# Altium schematic sheet Buck Converter.SchDoc: Buck Converter
size Letter; Author: Alfredo Cortellini; Organization: IT Logic; Address1: 5753 Highway 85 N; Address2: Crestview, FL 32536; Address3: United States; DocumentNumber: 4; SheetNumber: 4; SheetTotal: 5; Email: pcb-design@itlogic.cloud
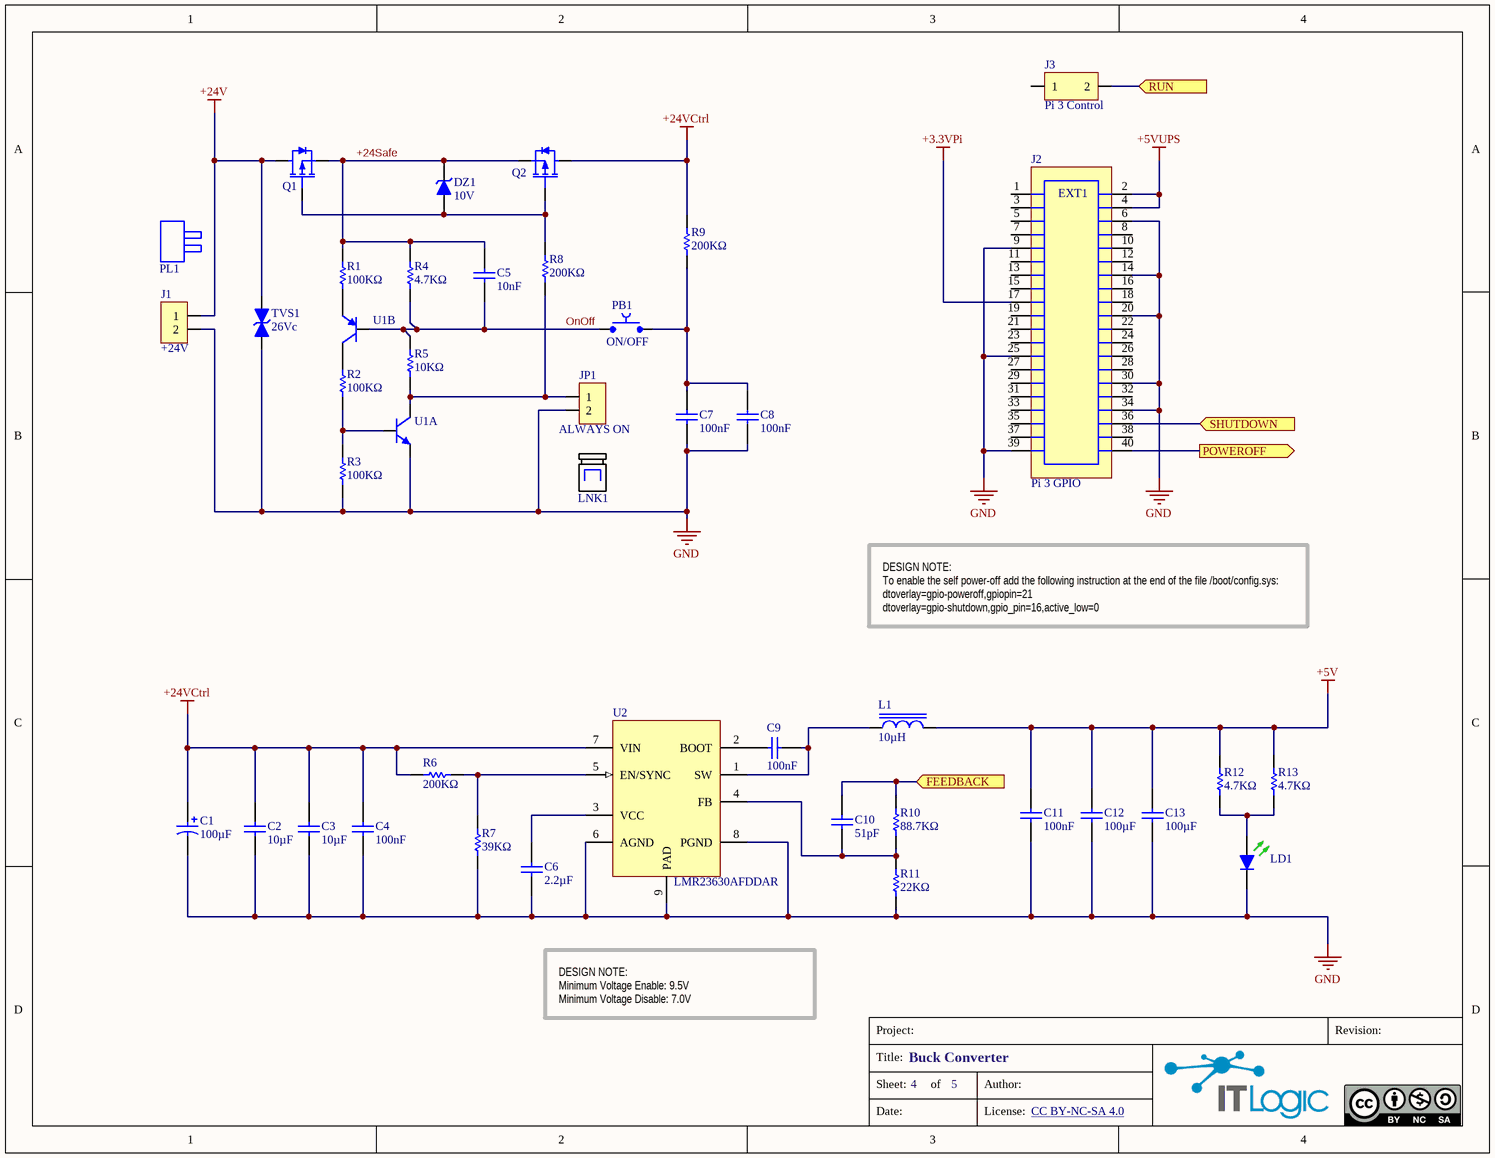
[diagram p0: Buck Converter.SchDoc]

## Parts
C1  100µF  [C-AE-C6-H60]
C2  10µF  [C1206-H180]
C3  10µF  [C1206-H180]
C4  100nF  [C0805-H10]
C5  10nF  [C0805-H10]
C6  2.2µF  [C0805-H140]
C7  100nF  [C0805-H10]
C8  100nF  [C0805-H10]
C9  100nF  [C0805-H10]
C10  51pF  [C0805-H10]
C11  100nF  [C0805-H10]
C12  100µF  [C1210-H250]
C13  100µF  [C1210-H250]
DZ1  10V  [SOD-123]
EXT1  SSQ-120-03-T-D-MEC  [SSQ-120-03-D-BOTTOM]  (value not drawn)
J1  +24V  [691322110002]
J2  Pi 3 GPIO  [HLE-120-02-F-DV-BE]
J3  Pi 3 Control  [SSQ-102-01-S-BOTTOM]
JP1  ALWAYS ON  [HDR-V-1R-02P-5.8L]
L1  10µH  [IND-XAL6060]
LD1  LTST-S220KGKT  [LED-0805-G-SIDE]  (value not drawn)
LNK1  2-881545-2  (value not drawn)  (mechanical)
PB1  ON/OFF  [BUT-1-1825027-4]
PL1  691361100002  (value not drawn)  (mechanical)
Q1  DMP6023LFG  [PowerDI3333-8-S]  (value not drawn)
Q2  DMP6023LFG  [PowerDI3333-8-S]  (value not drawn)
R1  100KΩ  [R0805-H60]
R2  100KΩ  [R0805-H60]
R3  100KΩ  [R0805-H60]
R4  4.7KΩ  [R0805-H60]
R5  10KΩ  [R0805-H60]
R6  200KΩ  [R0805-H60]
R7  39KΩ  [R0805-H60]
R8  200KΩ  [R0805-H60]
R9  200KΩ  [R0805-H60]
R10  88.7KΩ  [R0805-H60]
R11  22KΩ  [R0805-H60]
R12  4.7KΩ  [R0805-H60]
R13  4.7KΩ  [R0805-H60]
TVS1  26Vc  [DO-214AC-SMA-NO POL]
U1  MBT3946DW1T1G  [SOT-363]  (value not drawn)  (parts A,B of 2)
U2  LMR23630AFDDAR  [SOIC-8-N-HT]

## Ports
FEEDBACK (in), POWEROFF (out), RUN (in), SHUTDOWN (in)

## Nets
+3.3VPi: J2.17
+5V: C11.2 C12.2 C13.2 L1.2 R12.2 R13.2
+5VUPS: J2.2 J2.4
+24V: J1.1 Q1.3(D) TVS1.2
+24VCtrl: C1.1 C2.2 C3.2 C4.2 Q2.3(D) R6.2 R9.2 U2.7(VIN)
GND: C1.2 C2.1 C3.1 C4.1 C6.1 C7.1 C8.1 C11.1 C12.1 C13.1 J1.2 J2.6 J2.9 J2.14 J2.20 J2.25 J2.30 J2.34 J2.39 JP1.2 LD1.1(K) R3.1 R7.1 R11.1 TVS1.1 U1.1(E) U2.6(AGND) U2.8(PGND) U2.9(PAD)
+24Safe: C5.2 DZ1.1(K) Q1.1(S) Q2.1(S) R1.1 R4.2
FEEDBACK: C10.2 R10.2 ; port FEEDBACK
OnOff: C5.1 PB1.1 R4.1 R5.1 U1.5(B)
POWEROFF: J2.40 ; port POWEROFF
RUN: J3.2 ; port RUN
SHUTDOWN: J2.36 ; port SHUTDOWN
NetC6_2: C6.2 U2.3(VCC)
NetC7_2: C7.2 C8.2 PB1.2 R9.1
NetC9_1: C9.1 U2.2(BOOT)
NetC9_2: C9.2 L1.1 U2.1(SW)
NetC10_1: C10.1 R10.1 R11.2 U2.4(FB)
NetDZ1_2: DZ1.2(A) Q1.2(G) Q2.2(G) R8.2
NetJP1_1: JP1.1 R5.2 R8.1 U1.6(C)
NetLD1_2: LD1.2(A) R12.1 R13.1
NetR1_2: R1.2 U1.4(E)
NetR2_1: R2.1 R3.2 U1.2(B)
NetR2_2: R2.2 U1.3(C)
NetR6_1: R6.1 R7.2 U2.5(EN/SYNC)

Not connected (* = marked no-connect by the designer): J2 1 3 5 7 8 10 11 12 13 15 16 18 19 21 22 23 24 26 27 28 29 31 32 33 35 37 38; J3 1

## Notes on the sheet
- DESIGN NOTE:
  To enable the self power-off add the following instruction at the end of the file /boot/config.sys:
  dtoverlay=gpio-poweroff,gpiopin=21
  dtoverlay=gpio-shutdown,gpio_pin=16,active_low=0
- DESIGN NOTE:
  Minimum Voltage Enable: 9.5V
  Minimum Voltage Disable: 7.0V
- Project:
- Revision:
- Title:
- Sheet:
- of
- Author:
- Date:
- License:
- CC BY-NC-SA 4.0 <https://creativecommons.org/licenses/by-nc-sa/4.0/>

## Library data of the parts
C1 = EEE-FT1V101AP: Cap Electrolytic Alu 100uF 300V 20% (5.8 X 6.1mm) SMD 600mA 2000h 105C; Manufacturer: Panasonic; Voltage Rating: 35V; Resistance: 0.26R; Value: 100u; Manufacturer Part Number: EEE-FT1V101AP; Mount: Surface Mount; Capacitance: 100uF; ComponentLink1URL: https://industrial.panasonic.com/cdbs/www-data/pdf/RDE0000/ABA0000C1240.pdf; ComponentLink1Description: Data Sheet; Case: D8
C2 C3 = GRT31CR61H106ME01L: Cap 1206 Case Ceramic 10uF 50V X5S 20%; Manufacturer: Murata; Dielectric: X5R; Value: 10u; Manufacturer Part Number: GRT31CR61H106ME01L; Mount: Surface Mount; Case: 1206; Capacitance: 10uF; Voltage Rating: 50V; ComponentLink1URL: https://www.mouser.com/datasheet/2/400/lcc_commercial_general_en-837201.pdf; ComponentLink1Description: Data Sheet
C4 C7-C9 C11 = C0805C104K5RACTU: Cap 0805 Case Ceramic 100nF 50V X7R; Manufacturer: KEMET; Value: 100n; Manufacturer Part Number: C0805C104K5RACTU; Mount: Surface Mount; Case: 0805; Capacitance: 100nF; Dielectric: X7R; Voltage Rating: 50V; ComponentLink1URL: https://datasheet.ciiva.com/14589/70095383-14589048.pdf; ComponentLink1Description: Data Sheet
C5 = C0805C103K5RACTU: Cap 0805 Case Ceramic 10nF 50V X7R; Manufacturer: KEMET; Value: 10n; Manufacturer Part Number: C0805C103K5RACTU; Mount: Surface Mount; Case: 0805; Dielectric: X7R; Capacitance: 10nF; Voltage Rating: 50V; ComponentLink1URL: https://datasheet.ciiva.com/5904/kem-c1002-x7r-smd-5904709.pdf; ComponentLink1Description: Data Sheet
C6 = C0805C225K4RACTU: Cap 0805 Case Ceramic 2.2uF 16V X7R 10%; Manufacturer: KEMET; Capacitance: 22uF; Value: 2.2u; Manufacturer Part Number: C0805C225K4RACTU; Mount: Surface Mount; Case: 0805; Dielectric: X7R; Voltage Rating: 16V; ComponentLink1URL: http://components.arrow.com/part/dataview/0323_07281823; ComponentLink1Description: Data Sheet
C10 = C0805C510K5GACTU: Cap 0805 Case Ceramic 51pF 50V C0G 10%; Manufacturer: KEMET; Value: 51p; Manufacturer Part Number: C0805C510K5GACTU; Mount: Surface Mount; Case: 0805; Capacitance: 51pF; Dielectric: C0G; Voltage Rating: 50V; ComponentLink1URL: https://www.mouser.com/datasheet/2/212/KEM_C1003_C0G_SMD-1101588.pdf; ComponentLink1Description: Data Sheet
C12 C13 = GRM32ER61A107ME20L: Cap 1210 Case Ceramic 100uF 10V X5S 20%; Manufacturer: Murata; Dielectric: X5R; Value: 100u; Manufacturer Part Number: GRM32ER61A107ME20L; Mount: Surface Mount; Case: 1210; Capacitance: 100uF; Voltage Rating: 10V; ComponentLink1URL: https://www.mouser.com/datasheet/2/400/lcc_commercial_general_en-837201.pdf; ComponentLink1Description: Data Sheet
DZ1 = BZT52C10-E3-08: Diode Zener Single 10V 5% 400mW SOD-123; Manufacturer: Vishay Semiconductors; Manufacturer Part Number: BZT52C10-E3-08; Mount: Surface Mount; Case: SOD-123; Voltage Rating: 10V; ComponentLink1Description: Data Sheet; ComponentLink1URL: https://www.vishay.com/docs/85760/bzt52.pdf
EXT1 = SSQ-120-03-T-D-MEC: Conn Post Socket Header Vert - 2 Row - 20 Pos - 10 mm Lenght - Tin; Manufacturer: Samtec; Current Rating: 3A; Manufacturer Part Number: SSQ-120-03-T-D; Mount: Free Hanging; ComponentLink1URL: https://datasheet.ciiva.com/717/eng-cd-146256-g-146256-c-dwg-717712.pdf; ComponentLink1Description: Data Sheet
J1 = 691322110002: Conn Term Block Header 2 Pos 3.5 mm; Manufacturer: Wurth Electronics; Current Rating: 10A; Voltage Rating: 300V; Manufacturer Part Number: 691322110002; Mount: Through Hole; ComponentLink1URL: https://datasheet.ciiva.com/8043/1442234-8043560.pdf; ComponentLink1Description: Data Sheet
J2 = HLE-120-02-F-DV-BE: Conn Socket Header Vert - 2 Row - 20 Pos - SMD; Manufacturer: Samtec; Current Rating: 3A; Manufacturer Part Number: HLE-120-02-F-DV-BE; Mount: Surface Mount; ComponentLink1URL: https://datasheet.ciiva.com/717/eng-cd-146256-g-146256-c-dwg-717712.pdf; ComponentLink1Description: Data Sheet
J3 = SSQ-102-01-T-S: Conn Post Socket Header Vert - 1 Row - 2 Pos - 3 mm Lenght - Tin; Manufacturer: Samtec; Current Rating: 3A; Manufacturer Part Number: SSQ-102-01-T-S; Mount: Through Hole; ComponentLink1URL: https://datasheet.ciiva.com/717/eng-cd-146256-g-146256-c-dwg-717712.pdf; ComponentLink1Description: Data Sheet
JP1 = 22-28-4023: Breakaway Header Vert - 1 Row - 2 Pos - 6 mm Lenght - Gold; Manufacturer: Molex; Voltage Rating: 250V; Current Rating: 4A; Manufacturer Part Number: 22-28-4023; Mount: Through Hole; ComponentLink1URL: https://datasheet.ciiva.com/10088/0022284023-pcb-headers-10088337.pdf; ComponentLink1Description: Data Sheet
L1 = XAL6060-103MEB: Inductor Power XAL60 Series, 10uH, 7.6A,  Shielded, 27 mOhm, SMD; Manufacturer: Coilcraft; Value: 10u; Manufacturer Part Number: XAL6060-103MEB; Inductance: 10µH; ComponentLink1URL: https://www.coilcraft.com/xal50xx.cfm; ComponentLink1Description: Data Sheet; Mount: Surface Mount
LD1 = LTST-S220KGKT: LED 0805 Side Green 569nm 2-Pin; Manufacturer: Vishay Lite-On; Manufacturer Part Number: LTST-S220KGKT; Mount: Surface Mount; Case: 0805; ComponentLink1URL: https://www.tme.eu/Document/34ab2c4b8c99e859d5012ee3f8356040/LTST-S220GKT.pdf; ComponentLink1Description: Data Sheet
LNK1 = 2-881545-2: Jumper Red, 2 Pos, 2.54 pitch; Manufacturer: TE Connectivity; Manufacturer Part Number: 2-881545-2; ComponentLink1URL: https://datasheet.ciiva.com/3120/c-881545-k-3120181.pdf; ComponentLink1Description: Data Sheet; Mount: Free Hanging
PB1 = 1-1825027-4: Tactile Switch, Round Stem, Color ivory, Lenght 3.55mm, Right Angle, Through Hole.; Manufacturer: TE Connectivity; Voltage Rating: 24V; Current Rating: 50 mA; Manufacturer Part Number: 1-1825027-4; Mount: Through Hole; ComponentLink1URL: https://www.mouser.com/datasheet/2/418/NG_CD_1825027_G4-659945.pdf; ComponentLink1Description: Data Sheet
PL1 = 691361100002: Conn Term Block Plug Vert 2 Pos 3.5 mm; Manufacturer: Wurth Electronics; Current Rating: 10A; Voltage Rating: 300V; Manufacturer Part Number: 691361100002; Mount: Free Hanging; ComponentLink1URL: https://datasheet.ciiva.com/7992/1442235-7992395.pdf; ComponentLink1Description: Data Sheet
Q1 Q2 = DMP6023LFG: Mosfet P 60V Vds 20V Vgs 25mOhm PowerDI3333-8; Manufacturer: Diodes Incorporated; Manufacturer Part Number: DMP6023LFG; Mount: Surface Mount; Case: PowerDI3333-8; ComponentLink1Description: Data Sheet; ComponentLink1URL: https://www.diodes.com/assets/Datasheets/DMP6023LFG.pdf
R1-R3 = RC0805FR-07100KL: Resistor 0805 Case 100KR 1% 1/8W; Manufacturer: Yageo; Voltage Rating: 150V; Value: 100K; Manufacturer Part Number: RC0805FR-07100KL; Case: 0805; Resistance: 100kR; ComponentLink1URL: https://datasheet.ciiva.com/2457/pyu-r-int-thick-7-2457017.pdf; ComponentLink1Description: Data Sheet; Mount: Surface Mount
R4 R12 R13 = RC0805FR-074K7L: Resistor 0805 Case 4.7KR 1% 1/8W; Manufacturer: Yageo; Voltage Rating: 150V; Value: 4.7K; Manufacturer Part Number: RC0805FR-074K7L; Case: 0805; Resistance: 4.7kR; ComponentLink1URL: https://datasheet.ciiva.com/11808/0900766b8106beab-11808155.pdf; ComponentLink1Description: Data Sheet; Mount: Surface Mount
R5 = RC0805FR-0710KL: Resistor 0805 Case 10KR 1% 1/8W; Manufacturer: Yageo; Voltage Rating: 150V; Value: 10K; Manufacturer Part Number: RC0805FR-0710KL; Case: 0805; Resistance: 10kR; ComponentLink1URL: https://datasheet.ciiva.com/11808/0900766b8106beab-11808151.pdf; ComponentLink1Description: Data Sheet; Mount: Surface Mount
R6 R8 R9 = RC0805FR-07200KL: Resistor 0805 Case 200KR 1% 1/8W; Manufacturer: Yageo; Voltage Rating: 150V; Value: 200K; Manufacturer Part Number: RC0805FR-07200KL; Case: 0805; Resistance: 200kR; ComponentLink1URL: https://datasheet.ciiva.com/2457/pyu-r-int-thick-7-2457017.pdf; ComponentLink1Description: Data Sheet; Mount: Surface Mount
R7 = RC0805FR-0739KL: Resistor 0805 Case 39KR 1% 1/8W; Manufacturer: Yageo; Voltage Rating: 150V; Value: 39K; Manufacturer Part Number: RC0805FR-0739KL; Case: 0805; Resistance: 39KR; ComponentLink1URL: https://datasheet.ciiva.com/11808/0900766b8106beab-11808155.pdf; ComponentLink1Description: Data Sheet; Mount: Surface Mount
R10 = RC0805FR-0788K7L: Resistor 0805 Case 88.7KR 1% 1/8W; Manufacturer: Yageo; Voltage Rating: 150V; Value: 88.7K; Manufacturer Part Number: RC0805FR-0788K7L; Case: 0805; Resistance: 88.7kR; ComponentLink1URL: https://datasheet.ciiva.com/2457/pyu-r-int-thick-7-2457521.pdf; ComponentLink1Description: Data Sheet; Mount: Surface Mount
R11 = RC0805FR-0722KL: Resistor 0805 Case 22KR 1% 1/8W; Manufacturer: Yageo; Voltage Rating: 150V; Value: 22K; Manufacturer Part Number: RC0805FR-0722KL; Case: 0805; Resistance: 22kR; ComponentLink1URL: https://datasheet.ciiva.com/2457/pyu-r-int-thick-7-2457521.pdf; ComponentLink1Description: Data Sheet; Mount: Surface Mount
TVS1 = SMAJ26CA: TVS Diode Bidirectional 26Vs, 42.1Vc, 9.5 Amp, SMA; Manufacturer: Littelfuse; Manufacturer Part Number: SMAJ26CA; Mount: Surface Mount; ComponentLink1URL: https://datasheet.ciiva.com/332/littelfuse-tvs-diode-smdj-datasheet-pdf-332997.pdf; ComponentLink1Description: Data Sheet; Case: SMA
U1 = MBT3946DW1T1G: Transistor Complementary Dual 40V  200mA SOT−363; Manufacturer: ON Semiconductor; Manufacturer Part Number: MBT3946DW1T1G; Mount: Surface Mount; Case: SDIP-6; ComponentLink1URL: https://datasheet.ciiva.com/1249/683405-1249888.pdf; ComponentLink1Description: Data Sheet
U2 = LMR23630AFDDAR: Conv DC-DC Sync Step-Down 36V 3A 9-Pin(8+Pab) HSOIC-8; Manufacturer: Texas Instruments; Manufacturer Part Number: LMR23630AFDDAR; Mount: Surface Mount; Case: HSOIC-8; ComponentLink1URL: http://www.ti.com/lit/ds/symlink/lmr23630.pdf; ComponentLink1Description: Data Sheet